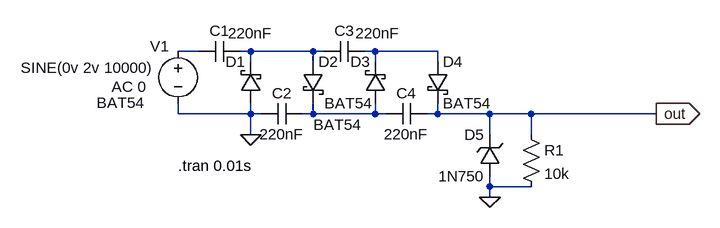
[diagram p0: schematic voltage doubler.asc]
voltage doubler.asc, the LTspice schematic file:
Version 4
SHEET 1 936 680
WIRE 128 112 96 112
WIRE 208 112 192 112
WIRE 304 112 208 112
WIRE 320 112 304 112
WIRE 400 112 384 112
WIRE 496 112 400 112
WIRE 208 128 208 112
WIRE 304 128 304 112
WIRE 400 128 400 112
WIRE 496 128 496 112
WIRE 96 208 96 192
WIRE 208 208 208 192
WIRE 208 208 96 208
WIRE 224 208 208 208
WIRE 304 208 304 192
WIRE 304 208 288 208
WIRE 400 208 400 192
WIRE 400 208 304 208
WIRE 416 208 400 208
WIRE 496 208 496 192
WIRE 496 208 480 208
WIRE 576 208 496 208
WIRE 640 208 576 208
WIRE 832 208 640 208
WIRE 208 240 208 208
WIRE 576 240 576 208
WIRE 640 240 640 208
WIRE 576 320 576 304
WIRE 640 320 576 320
WIRE 576 336 576 320
FLAG 208 240 0
FLAG 576 336 0
FLAG 832 208 out
IOPIN 832 208 Out
SYMBOL cap 192 96 R90
WINDOW 0 0 32 VBottom 2
WINDOW 3 -28 -16 VTop 2
SYMATTR InstName C1
SYMATTR Value 220nF
SYMBOL cap 288 192 R90
WINDOW 0 0 32 VBottom 2
WINDOW 3 32 32 VTop 2
SYMATTR InstName C2
SYMATTR Value 220nF
SYMBOL cap 384 96 R90
WINDOW 0 0 32 VBottom 2
WINDOW 3 -28 -20 VTop 2
SYMATTR InstName C3
SYMATTR Value 220nF
SYMBOL cap 480 192 R90
WINDOW 0 0 32 VBottom 2
WINDOW 3 32 32 VTop 2
SYMATTR InstName C4
SYMATTR Value 220nF
SYMBOL schottky 224 192 R180
WINDOW 0 24 64 Left 2
WINDOW 3 180 1 Left 2
SYMATTR InstName D1
SYMATTR Value BAT54
SYMATTR Description Diode
SYMATTR Type diode
SYMBOL schottky 288 128 R0
WINDOW 3 17 97 Left 2
SYMATTR InstName D2
SYMATTR Value BAT54
SYMATTR Description Diode
SYMATTR Type diode
SYMBOL schottky 416 192 R180
WINDOW 0 24 64 Left 2
WINDOW 3 21 0 Left 2
SYMATTR InstName D3
SYMATTR Value BAT54
SYMATTR Description Diode
SYMATTR Type diode
SYMBOL schottky 480 128 R0
SYMATTR InstName D4
SYMATTR Value BAT54
SYMATTR Description Diode
SYMATTR Type diode
SYMBOL res 624 224 R0
SYMATTR InstName R1
SYMATTR Value 10k
SYMBOL voltage 96 96 R0
WINDOW 3 -242 41 Left 2
WINDOW 123 -102 70 Left 2
WINDOW 39 0 0 Left 2
WINDOW 0 -43 8 Left 2
SYMATTR Value SINE(0v 2v 10000)
SYMATTR Value2 AC 0
SYMATTR InstName V1
SYMBOL zener 592 304 R180
WINDOW 0 24 64 Left 2
WINDOW 3 24 0 Left 2
SYMATTR InstName D5
SYMATTR Value 1N750
TEXT 96 288 Left 2 !.tran 0.01s

The netlist it stands for:
* voltage doubler.asc
C1 N002 N001 220nF
C2 N004 0 220nF
C3 N003 N002 220nF
C4 out N004 220nF
D1 0 N002 BAT54
D2 N002 N004 BAT54
D3 N004 N003 BAT54
D4 N003 out BAT54
R1 out 0 10k
V1 N001 0 SINE(0v 2v 10000) AC 0
D5 0 out 1N750
.model D D
.lib standard.dio
.tran 0.01s
.backanno
.end